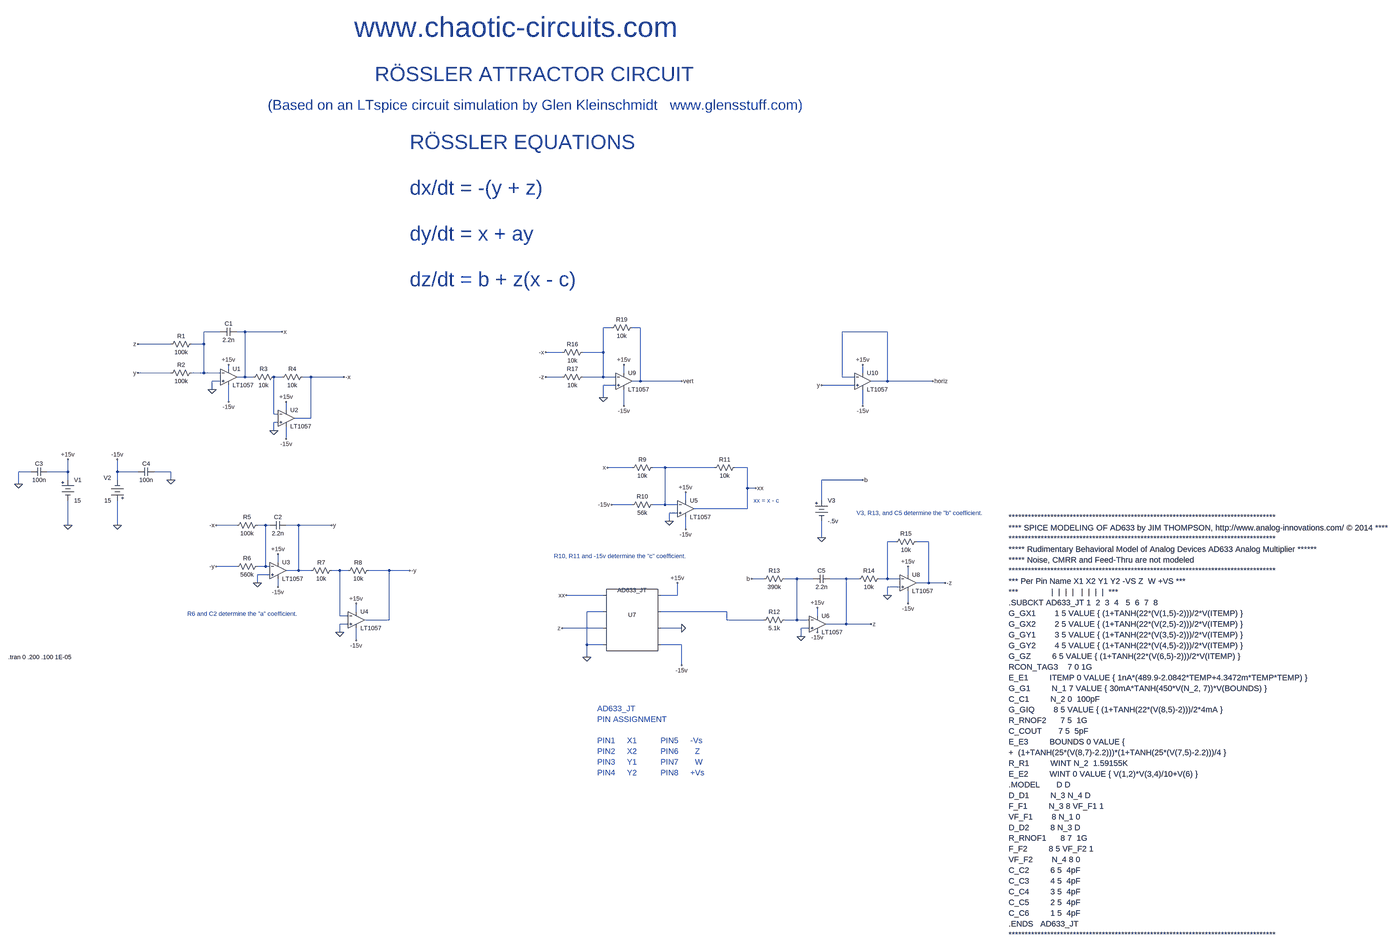
[diagram p0: schematic roessler.asc, whole sheet]
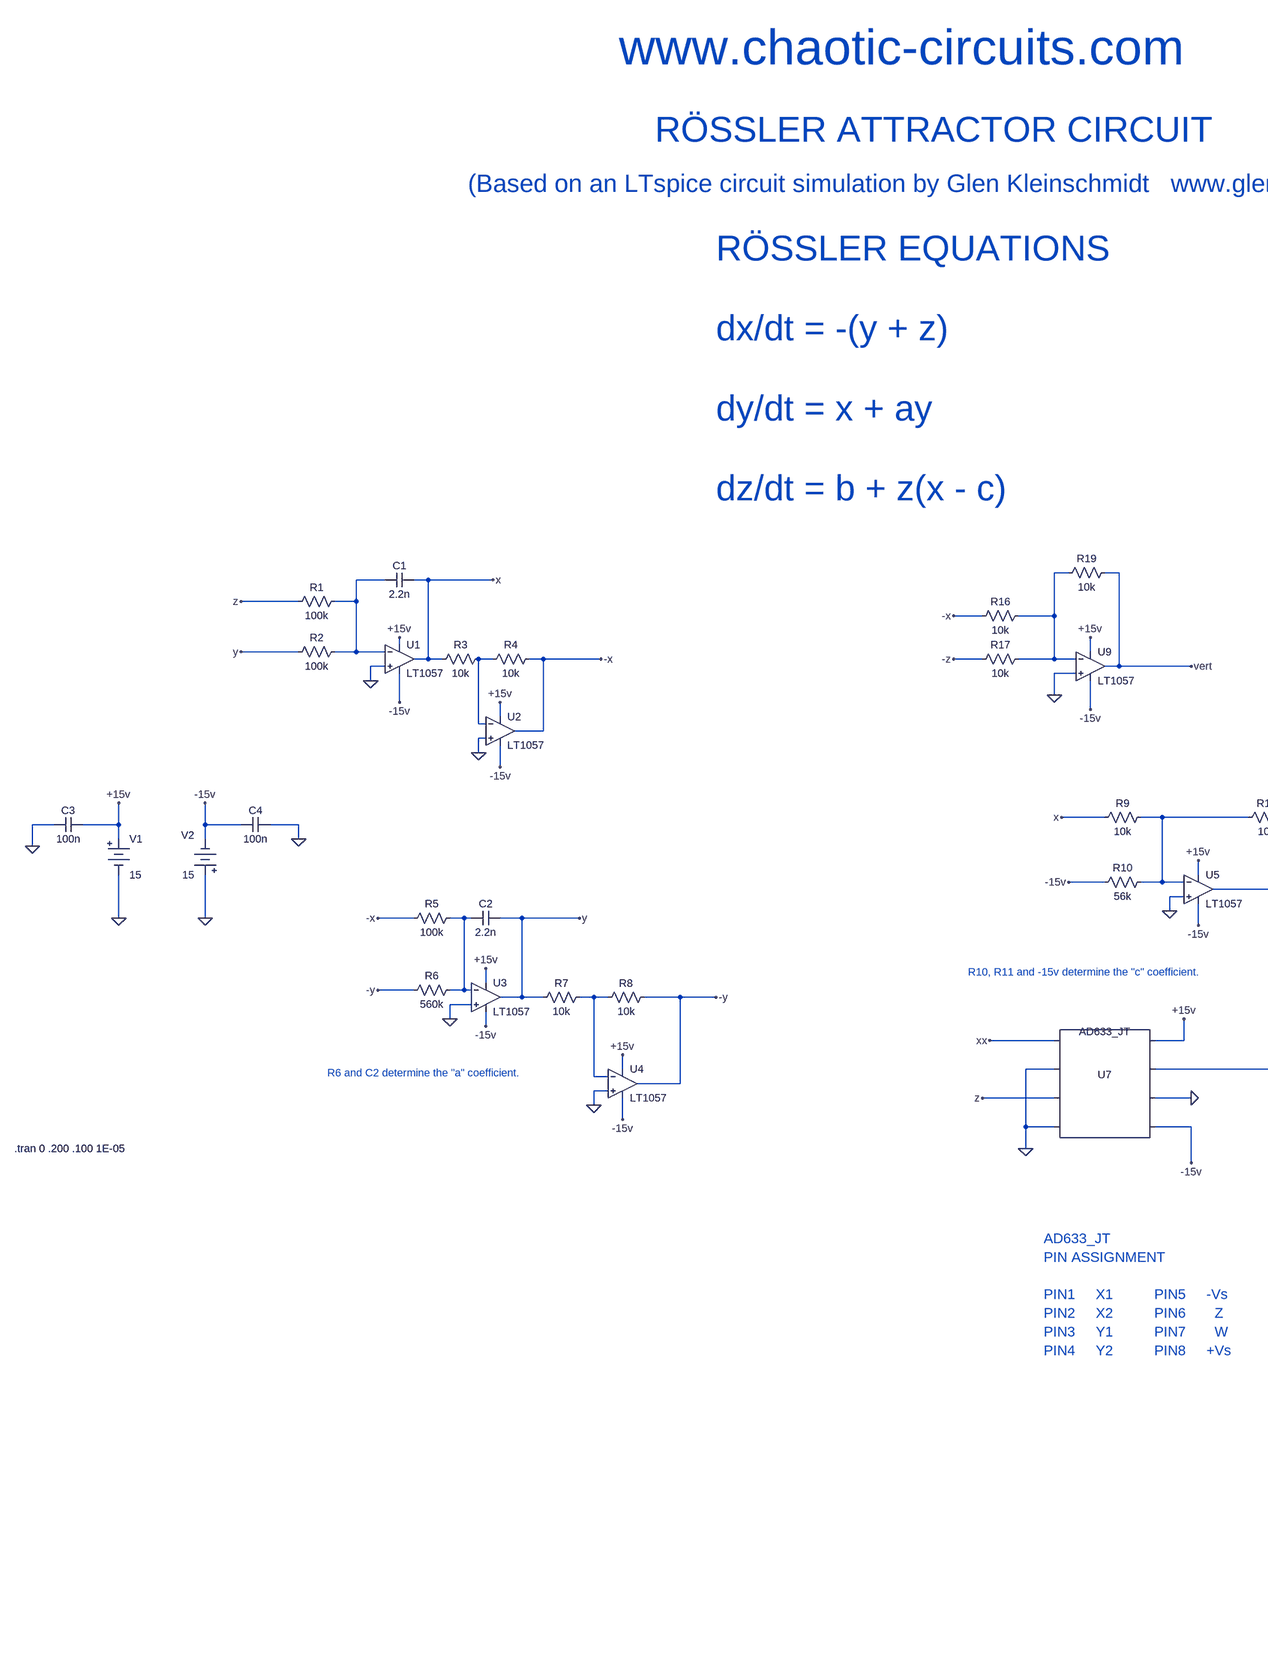
[diagram p1: schematic roessler.asc, part, row 1 of 1, column 1 of 2]
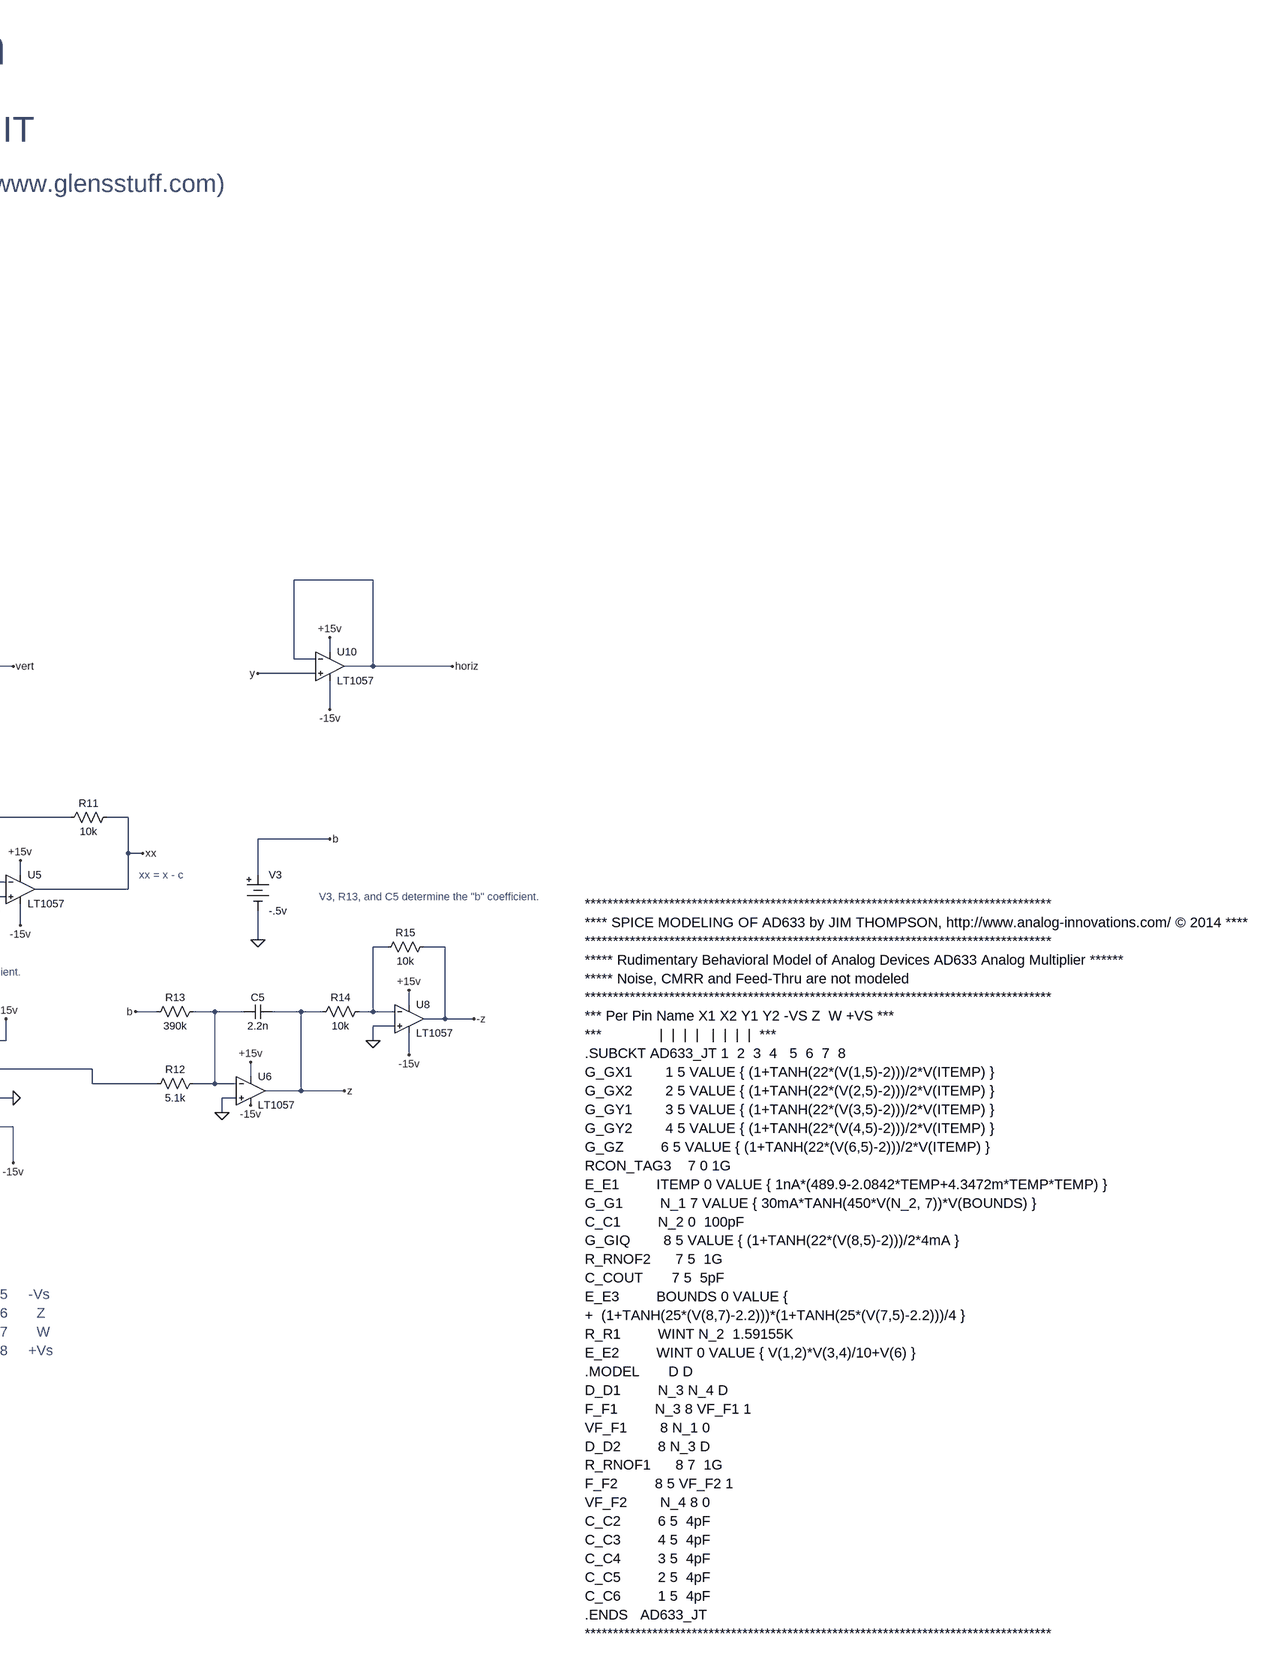
[diagram p2: schematic roessler.asc, part, row 1 of 1, column 2 of 2]
roessler.asc, the LTspice schematic file:
Version 4
SHEET 1 2320 3272
WIRE -2512 976 -2544 976
WIRE -2400 976 -2432 976
WIRE -4032 992 -4096 992
WIRE -3936 992 -3968 992
WIRE -3792 992 -3936 992
WIRE -1440 992 -1616 992
WIRE -4224 1040 -4352 1040
WIRE -4096 1040 -4096 992
WIRE -4096 1040 -4144 1040
WIRE -2704 1072 -2768 1072
WIRE -2544 1072 -2544 976
WIRE -2544 1072 -2624 1072
WIRE -4000 1136 -4000 1120
WIRE -4224 1152 -4352 1152
WIRE -4096 1152 -4096 1040
WIRE -4096 1152 -4144 1152
WIRE -4032 1152 -4096 1152
WIRE -2464 1152 -2464 1120
WIRE -1536 1152 -1536 1120
WIRE -3936 1168 -3936 992
WIRE -3936 1168 -3968 1168
WIRE -3904 1168 -3936 1168
WIRE -3792 1168 -3824 1168
WIRE -3680 1168 -3712 1168
WIRE -3552 1168 -3680 1168
WIRE -2704 1168 -2768 1168
WIRE -2544 1168 -2544 1072
WIRE -2544 1168 -2624 1168
WIRE -2496 1168 -2544 1168
WIRE -1616 1168 -1616 992
WIRE -1568 1168 -1616 1168
WIRE -4032 1184 -4064 1184
WIRE -2400 1184 -2400 976
WIRE -2400 1184 -2432 1184
WIRE -2240 1184 -2400 1184
WIRE -1440 1184 -1440 992
WIRE -1440 1184 -1504 1184
WIRE -1264 1184 -1440 1184
WIRE -2496 1200 -2544 1200
WIRE -1568 1200 -1696 1200
WIRE -4064 1216 -4064 1184
WIRE -2544 1248 -2544 1200
WIRE -4000 1264 -4000 1200
WIRE -2464 1280 -2464 1216
WIRE -1536 1280 -1536 1216
WIRE -3776 1296 -3776 1264
WIRE -3824 1312 -3824 1168
WIRE -3808 1312 -3824 1312
WIRE -3680 1328 -3680 1168
WIRE -3680 1328 -3744 1328
WIRE -3808 1344 -3824 1344
WIRE -3824 1376 -3824 1344
WIRE -3776 1408 -3776 1360
WIRE -2432 1520 -2528 1520
WIRE -2304 1520 -2352 1520
WIRE -2112 1520 -2304 1520
WIRE -1984 1520 -2032 1520
WIRE -4768 1536 -4816 1536
WIRE -4624 1536 -4624 1488
WIRE -4624 1536 -4704 1536
WIRE -4432 1536 -4432 1488
WIRE -4352 1536 -4432 1536
WIRE -4224 1536 -4288 1536
WIRE -4624 1568 -4624 1536
WIRE -4432 1568 -4432 1536
WIRE -4224 1568 -4224 1536
WIRE -1536 1568 -1696 1568
WIRE -4816 1584 -4816 1536
WIRE -1984 1600 -1984 1520
WIRE -1952 1600 -1984 1600
WIRE -2224 1648 -2224 1616
WIRE -1696 1648 -1696 1568
WIRE -2432 1664 -2512 1664
WIRE -2304 1664 -2304 1520
WIRE -2304 1664 -2352 1664
WIRE -2256 1664 -2304 1664
WIRE -1984 1680 -1984 1600
WIRE -1984 1680 -2192 1680
WIRE -2256 1696 -2288 1696
WIRE -2288 1728 -2288 1696
WIRE -4624 1744 -4624 1648
WIRE -4432 1744 -4432 1648
WIRE -3968 1744 -4048 1744
WIRE -3856 1744 -3888 1744
WIRE -3840 1744 -3856 1744
WIRE -3728 1744 -3776 1744
WIRE -3600 1744 -3728 1744
WIRE -2224 1760 -2224 1712
WIRE -1696 1792 -1696 1728
WIRE -1408 1808 -1440 1808
WIRE -1280 1808 -1328 1808
WIRE -3808 1888 -3808 1856
WIRE -3968 1904 -4048 1904
WIRE -3856 1904 -3856 1744
WIRE -3856 1904 -3888 1904
WIRE -3840 1904 -3856 1904
WIRE -3728 1920 -3728 1744
WIRE -3728 1920 -3776 1920
WIRE -3680 1920 -3728 1920
WIRE -3568 1920 -3600 1920
WIRE -3536 1920 -3568 1920
WIRE -3376 1920 -3456 1920
WIRE -3296 1920 -3376 1920
WIRE -3840 1936 -3888 1936
WIRE -1360 1936 -1360 1904
WIRE -1920 1952 -1968 1952
WIRE -1792 1952 -1840 1952
WIRE -1728 1952 -1792 1952
WIRE -1600 1952 -1664 1952
WIRE -1552 1952 -1600 1952
WIRE -1440 1952 -1440 1808
WIRE -1440 1952 -1472 1952
WIRE -1392 1952 -1440 1952
WIRE -3888 1968 -3888 1936
WIRE -1280 1968 -1280 1808
WIRE -1280 1968 -1328 1968
WIRE -1216 1968 -1280 1968
WIRE -3808 1984 -3808 1952
WIRE -1392 1984 -1440 1984
WIRE -2544 2016 -2688 2016
WIRE -2256 2016 -2256 1968
WIRE -2256 2016 -2320 2016
WIRE -1440 2016 -1440 1984
WIRE -1360 2048 -1360 2000
WIRE -3504 2080 -3504 2048
WIRE -2544 2080 -2608 2080
WIRE -2064 2080 -2320 2080
WIRE -3568 2096 -3568 1920
WIRE -3536 2096 -3568 2096
WIRE -1712 2096 -1712 2064
WIRE -3376 2112 -3376 1920
WIRE -3376 2112 -3472 2112
WIRE -2064 2112 -2064 2080
WIRE -1920 2112 -2064 2112
WIRE -1792 2112 -1792 1952
WIRE -1792 2112 -1840 2112
WIRE -1744 2112 -1792 2112
WIRE -3536 2128 -3568 2128
WIRE -1600 2128 -1600 1952
WIRE -1600 2128 -1680 2128
WIRE -1504 2128 -1600 2128
WIRE -2544 2144 -2704 2144
WIRE -2240 2144 -2320 2144
WIRE -1744 2144 -1776 2144
WIRE -3568 2160 -3568 2128
WIRE -1776 2176 -1776 2144
WIRE -3504 2192 -3504 2144
WIRE -2608 2208 -2608 2080
WIRE -2544 2208 -2608 2208
WIRE -2240 2208 -2320 2208
WIRE -2608 2256 -2608 2208
WIRE -2240 2288 -2240 2208
FLAG -3776 1264 +15v
FLAG -3808 1856 +15v
FLAG -3504 2048 +15v
FLAG -2224 1616 +15v
FLAG -1712 2064 +15v
FLAG -4000 1120 +15v
FLAG -4000 1264 -15v
FLAG -3776 1408 -15v
FLAG -3808 1984 -15v
FLAG -3504 2192 -15v
FLAG -2224 1760 -15v
FLAG -1712 2160 -15v
FLAG -3888 1968 0
FLAG -4064 1216 0
FLAG -3824 1376 0
FLAG -3568 2160 0
FLAG -2288 1728 0
FLAG -1776 2176 0
FLAG -4352 1040 z
FLAG -4352 1152 y
FLAG -3792 992 x
FLAG -3552 1168 -x
FLAG -4624 1744 0
FLAG -4432 1744 0
FLAG -4624 1488 +15v
FLAG -4432 1488 -15v
FLAG -4224 1568 0
FLAG -4816 1584 0
FLAG -4048 1744 -x
FLAG -3296 1920 -y
FLAG -4048 1904 -y
FLAG -3600 1744 y
FLAG -2528 1520 x
FLAG -2512 1664 -15v
FLAG -1504 2128 z
FLAG -1696 1792 0
FLAG -1536 1568 b
FLAG -1968 1952 b
FLAG -1440 2016 0
FLAG -2544 1248 0
FLAG -1216 1968 -z
FLAG -1360 1904 +15v
FLAG -2464 1120 +15v
FLAG -2464 1280 -15v
FLAG -1360 2048 -15v
FLAG -2768 1072 -x
FLAG -2768 1168 -z
FLAG -2240 1184 vert
FLAG -1536 1280 -15v
FLAG -1536 1120 +15v
FLAG -1696 1200 y
FLAG -1264 1184 horiz
FLAG -1952 1600 xx
FLAG -2688 2016 xx
FLAG -2704 2144 z
FLAG -2608 2256 0
FLAG -2240 2144 0
FLAG -2256 1968 +15v
FLAG -2240 2288 -15v
SYMBOL Opamps\\LT1057 -4000 1104 R0
SYMATTR InstName U1
SYMBOL Opamps\\LT1057 -3776 1264 R0
SYMATTR InstName U2
SYMBOL Opamps\\LT1057 -3808 1856 R0
SYMATTR InstName U3
SYMBOL Opamps\\LT1057 -3504 2048 R0
SYMATTR InstName U4
SYMBOL Opamps\\LT1057 -2224 1616 R0
SYMATTR InstName U5
SYMBOL Opamps\\LT1057 -1712 2064 R0
SYMATTR InstName U6
SYMBOL res -4240 1056 R270
WINDOW 0 32 56 VTop 2
WINDOW 3 0 56 VBottom 2
SYMATTR InstName R1
SYMATTR Value 100k
SYMBOL res -4240 1168 R270
WINDOW 0 32 56 VTop 2
WINDOW 3 0 56 VBottom 2
SYMATTR InstName R2
SYMATTR Value 100k
SYMBOL res -3920 1184 R270
WINDOW 0 32 56 VTop 2
WINDOW 3 0 56 VBottom 2
SYMATTR InstName R3
SYMATTR Value 10k
SYMBOL res -3808 1184 R270
WINDOW 0 32 56 VTop 2
WINDOW 3 0 56 VBottom 2
SYMATTR InstName R4
SYMATTR Value 10k
SYMBOL cap -3840 1760 R270
WINDOW 0 32 32 VTop 2
WINDOW 3 0 32 VBottom 2
SYMATTR InstName C2
SYMATTR Value 2.2n
SYMBOL Misc\\battery -4624 1552 R0
WINDOW 123 0 0 Left 2
WINDOW 39 0 0 Left 2
SYMATTR InstName V1
SYMATTR Value 15
SYMBOL Misc\\battery -4432 1664 R180
WINDOW 0 24 104 Left 2
WINDOW 3 24 16 Left 2
WINDOW 123 0 0 Left 2
WINDOW 39 0 0 Left 2
SYMATTR InstName V2
SYMATTR Value 15
SYMBOL cap -4704 1520 R90
WINDOW 0 0 32 VBottom 2
WINDOW 3 32 32 VTop 2
SYMATTR InstName C3
SYMATTR Value 100n
SYMBOL cap -4288 1520 R90
WINDOW 0 0 32 VBottom 2
WINDOW 3 32 32 VTop 2
SYMATTR InstName C4
SYMATTR Value 100n
SYMBOL res -3872 1728 R90
WINDOW 0 0 56 VBottom 2
WINDOW 3 32 56 VTop 2
SYMATTR InstName R5
SYMATTR Value 100k
SYMBOL res -3872 1888 R90
WINDOW 0 0 56 VBottom 2
WINDOW 3 32 56 VTop 2
SYMATTR InstName R6
SYMATTR Value 560k
SYMBOL res -3584 1904 R90
WINDOW 0 0 56 VBottom 2
WINDOW 3 32 56 VTop 2
SYMATTR InstName R7
SYMATTR Value 10k
SYMBOL res -3440 1904 R90
WINDOW 0 0 56 VBottom 2
WINDOW 3 32 56 VTop 2
SYMATTR InstName R8
SYMATTR Value 10k
SYMBOL res -2336 1504 R90
WINDOW 0 0 56 VBottom 2
WINDOW 3 32 56 VTop 2
SYMATTR InstName R9
SYMATTR Value 10k
SYMBOL res -2336 1648 R90
WINDOW 0 0 56 VBottom 2
WINDOW 3 32 56 VTop 2
SYMATTR InstName R10
SYMATTR Value 56k
SYMBOL res -2016 1504 R90
WINDOW 0 0 56 VBottom 2
WINDOW 3 32 56 VTop 2
SYMATTR InstName R11
SYMATTR Value 10k
SYMBOL res -1824 2096 R90
WINDOW 0 0 56 VBottom 2
WINDOW 3 32 56 VTop 2
SYMATTR InstName R12
SYMATTR Value 5.1k
SYMBOL res -1824 1936 R90
WINDOW 0 0 56 VBottom 2
WINDOW 3 32 56 VTop 2
SYMATTR InstName R13
SYMATTR Value 390k
SYMBOL cap -1664 1936 R90
WINDOW 0 0 32 VBottom 2
WINDOW 3 32 32 VTop 2
SYMATTR InstName C5
SYMATTR Value 2.2n
SYMBOL Misc\\battery -1696 1632 R0
WINDOW 123 0 0 Left 2
WINDOW 39 0 0 Left 2
SYMATTR InstName V3
SYMATTR Value -.5v
SYMBOL cap -3968 976 R90
WINDOW 0 0 32 VBottom 2
WINDOW 3 32 32 VTop 2
SYMATTR InstName C1
SYMATTR Value 2.2n
SYMBOL Opamps\\LT1057 -2464 1120 R0
SYMATTR InstName U9
SYMBOL Opamps\\LT1057 -1360 1904 R0
SYMATTR InstName U8
SYMBOL res -1456 1936 R90
WINDOW 0 0 56 VBottom 2
WINDOW 3 32 56 VTop 2
SYMATTR InstName R14
SYMATTR Value 10k
SYMBOL res -1312 1792 R90
WINDOW 0 0 56 VBottom 2
WINDOW 3 32 56 VTop 2
SYMATTR InstName R15
SYMATTR Value 10k
SYMBOL res -2608 1056 R90
WINDOW 0 0 56 VBottom 2
WINDOW 3 32 56 VTop 2
SYMATTR InstName R16
SYMATTR Value 10k
SYMBOL res -2608 1152 R90
WINDOW 0 0 56 VBottom 2
WINDOW 3 32 56 VTop 2
SYMATTR InstName R17
SYMATTR Value 10k
SYMBOL res -2416 960 R90
WINDOW 0 0 56 VBottom 2
WINDOW 3 32 56 VTop 2
SYMATTR InstName R19
SYMATTR Value 10k
SYMBOL Opamps\\LT1057 -1536 1120 R0
SYMATTR InstName U10
SYMBOL Misc\\DIP8 -2432 2112 R0
WINDOW 3 0 -116 Center 2
SYMATTR InstName U7
SYMATTR Value AD633_JT
TEXT -4856 2256 Left 2 !.tran 0 .200 .100 1E-05
TEXT -2736 1864 Left 2 ;R10, R11 and -15v determine the "c" coefficient.
TEXT -4160 2088 Left 2 ;R6 and C2 determine the "a" coefficient.
TEXT -1560 1696 Left 2 ;V3, R13, and C5 determine the "b" coefficient.
TEXT -1960 1648 Left 2 ;xx = x - c
TEXT -3432 -288 Left 6 ;RÖSSLER ATTRACTOR CIRCUIT
TEXT -3848 -168 Left 5 ;(Based on an LTspice circuit simulation by Glen Kleinschmidt   www.glensstuff.com)
TEXT -3512 -496 Left 7 ;www.chaotic-circuits.com
TEXT -3296 -24 Left 6 ;RÖSSLER EQUATIONS\n \ndx/dt = -(y + z) \n \ndy/dt = x + ay\n \ndz/dt = b + z(x - c)
TEXT -816 1712 Left 3 !***********************************************************************************\n**** SPICE MODELING OF AD633 by JIM THOMPSON, http://www.analog-innovations.com/ © 2014 ****\n***********************************************************************************\n***** Rudimentary Behavioral Model of Analog Devices AD633 Analog Multiplier ******\n***** Noise, CMRR and Feed-Thru are not modeled\n***********************************************************************************\n*** Per Pin Name X1 X2 Y1 Y2 -VS Z  W +VS ***\n***              |  |  |  |   |  |  |  |  ***\n.SUBCKT AD633_JT 1  2  3  4   5  6  7  8 \nG_GX1        1 5 VALUE { (1+TANH(22*(V(1,5)-2)))/2*V(ITEMP) }\nG_GX2        2 5 VALUE { (1+TANH(22*(V(2,5)-2)))/2*V(ITEMP) }\nG_GY1        3 5 VALUE { (1+TANH(22*(V(3,5)-2)))/2*V(ITEMP) }\nG_GY2        4 5 VALUE { (1+TANH(22*(V(4,5)-2)))/2*V(ITEMP) }\nG_GZ         6 5 VALUE { (1+TANH(22*(V(6,5)-2)))/2*V(ITEMP) }\nRCON_TAG3    7 0 1G\nE_E1         ITEMP 0 VALUE { 1nA*(489.9-2.0842*TEMP+4.3472m*TEMP*TEMP) }\nG_G1         N_1 7 VALUE { 30mA*TANH(450*V(N_2, 7))*V(BOUNDS) }\nC_C1         N_2 0  100pF \nG_GIQ        8 5 VALUE { (1+TANH(22*(V(8,5)-2)))/2*4mA }\nR_RNOF2      7 5  1G \nC_COUT       7 5  5pF \nE_E3         BOUNDS 0 VALUE {\n+  (1+TANH(25*(V(8,7)-2.2)))*(1+TANH(25*(V(7,5)-2.2)))/4 }\nR_R1         WINT N_2  1.59155K \nE_E2         WINT 0 VALUE { V(1,2)*V(3,4)/10+V(6) }\n.MODEL       D D\nD_D1         N_3 N_4 D \nF_F1         N_3 8 VF_F1 1\nVF_F1        8 N_1 0\nD_D2         8 N_3 D \nR_RNOF1      8 7  1G \nF_F2         8 5 VF_F2 1\nVF_F2        N_4 8 0\nC_C2         6 5  4pF \nC_C3         4 5  4pF \nC_C4         3 5  4pF \nC_C5         2 5  4pF \nC_C6         1 5  4pF \n.ENDS   AD633_JT\n***********************************************************************************
TEXT -2568 2456 Left 3 ;AD633_JT\nPIN ASSIGNMENT\n \nPIN1     X1          PIN5     -Vs\nPIN2     X2          PIN6       Z\nPIN3     Y1          PIN7       W\nPIN4     Y2          PIN8     +Vs

The netlist it stands for:
* roessler.asc
XU1 0 N002 +15v -15v x LT1057  ; pins In+ In- V+ V- OUT
XU2 0 N003 +15v -15v -x LT1057  ; pins In+ In- V+ V- OUT
XU3 0 N005 +15v -15v y LT1057  ; pins In+ In- V+ V- OUT
XU4 0 N007 +15v -15v -y LT1057  ; pins In+ In- V+ V- OUT
XU5 0 N004 +15v -15v xx LT1057  ; pins In+ In- V+ V- OUT
XU6 0 N008 +15v -15v z LT1057  ; pins In+ In- V+ V- OUT
R1 z N002 100k
R2 y N002 100k
R3 x N003 10k
R4 N003 -x 10k
C2 N005 y 2.2n
V1 +15v 0 15
V2 0 -15v 15
C3 +15v 0 100n
C4 0 -15v 100n
R5 N005 -x 100k
R6 N005 -y 560k
R7 N007 y 10k
R8 -y N007 10k
R9 N004 x 10k
R10 N004 -15v 56k
R11 xx N004 10k
R12 N008 N009 5.1k
R13 N008 b 390k
C5 z N008 2.2n
V3 b 0 -.5v
C1 x N002 2.2n
XU9 0 N001 +15v -15v vert LT1057  ; pins In+ In- V+ V- OUT
XU8 0 N006 +15v -15v -z LT1057  ; pins In+ In- V+ V- OUT
R14 N006 z 10k
R15 -z N006 10k
R16 N001 -x 10k
R17 N001 -z 10k
R19 vert N001 10k
XU10 y horiz +15v -15v horiz LT1057  ; pins In+ In- V+ V- OUT
XU7 xx 0 z 0 -15v 0 N009 +15v AD633_JT
.tran 0 .200 .100 1E-05
* R10, R11 and -15v determine the "c" coefficient.
* R6 and C2 determine the "a" coefficient.
* V3, R13, and C5 determine the "b" coefficient.
* xx = x - c
* RÖSSLER ATTRACTOR CIRCUIT
* (Based on an LTspice circuit simulation by Glen Kleinschmidt   www.glensstuff.com)
* www.chaotic-circuits.com
* RÖSSLER EQUATIONS
* dx/dt = -(y + z)
* dy/dt = x + ay
* dz/dt = b + z(x - c)
***********************************************************************************
**** SPICE MODELING OF AD633 by JIM THOMPSON, http://www.analog-innovations.com/ © 2014 ****
***********************************************************************************
***** Rudimentary Behavioral Model of Analog Devices AD633 Analog Multiplier ******
***** Noise, CMRR and Feed-Thru are not modeled
***********************************************************************************
*** Per Pin Name X1 X2 Y1 Y2 -VS Z  W +VS ***
***              |  |  |  |   |  |  |  |  ***
.SUBCKT AD633_JT 1  2  3  4   5  6  7  8
G_GX1        1 5 VALUE { (1+TANH(22*(V(1,5)-2)))/2*V(ITEMP) }
G_GX2        2 5 VALUE { (1+TANH(22*(V(2,5)-2)))/2*V(ITEMP) }
G_GY1        3 5 VALUE { (1+TANH(22*(V(3,5)-2)))/2*V(ITEMP) }
G_GY2        4 5 VALUE { (1+TANH(22*(V(4,5)-2)))/2*V(ITEMP) }
G_GZ         6 5 VALUE { (1+TANH(22*(V(6,5)-2)))/2*V(ITEMP) }
RCON_TAG3    7 0 1G
E_E1         ITEMP 0 VALUE { 1nA*(489.9-2.0842*TEMP+4.3472m*TEMP*TEMP) }
G_G1         N_1 7 VALUE { 30mA*TANH(450*V(N_2, 7))*V(BOUNDS) }
C_C1         N_2 0  100pF
G_GIQ        8 5 VALUE { (1+TANH(22*(V(8,5)-2)))/2*4mA }
R_RNOF2      7 5  1G
C_COUT       7 5  5pF
E_E3         BOUNDS 0 VALUE {
+  (1+TANH(25*(V(8,7)-2.2)))*(1+TANH(25*(V(7,5)-2.2)))/4 }
R_R1         WINT N_2  1.59155K
E_E2         WINT 0 VALUE { V(1,2)*V(3,4)/10+V(6) }
.MODEL       D D
D_D1         N_3 N_4 D
F_F1         N_3 8 VF_F1 1
VF_F1        8 N_1 0
D_D2         8 N_3 D
R_RNOF1      8 7  1G
F_F2         8 5 VF_F2 1
VF_F2        N_4 8 0
C_C2         6 5  4pF
C_C3         4 5  4pF
C_C4         3 5  4pF
C_C5         2 5  4pF
C_C6         1 5  4pF
.ENDS   AD633_JT
***********************************************************************************
* AD633_JT
* PIN ASSIGNMENT
* PIN1     X1          PIN5     -Vs
* PIN2     X2          PIN6       Z
* PIN3     Y1          PIN7       W
* PIN4     Y2          PIN8     +Vs
.lib LTC.lib
.backanno
.end